# Altium schematic sheet power_supply_blk.SchDoc
size A4; Date: 1/11/2016; Engineer: JBayalas; DocumentNumber: 7; Revision: V4.3.0; SheetNumber: 7; SheetTotal: 12
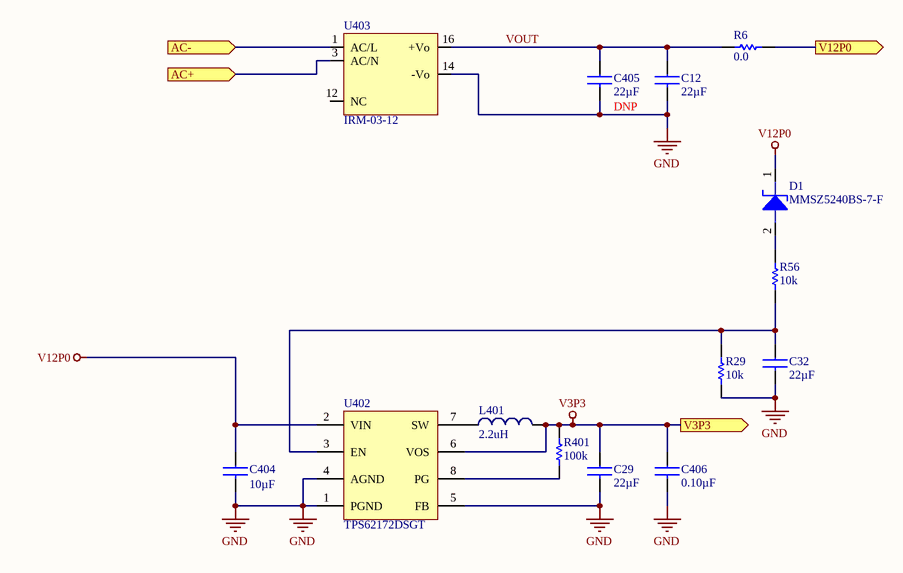
[diagram p0: power_supply_blk.SchDoc]

## Parts
C12  value 22µF  [C0805]  (hidden comment: GRM219R61C226ME15L)
C29  value 22µF  [C0805]  (hidden comment: GRM21BR61C226ME44L)
C32  value 22µF  [C0805]  (hidden comment: GRM219R61C226ME15L)
C404  value 10µF  [C1206]  (hidden comment: GRM31CR71C106KAC7L)
C405  value 22µF  [C0805]  (hidden comment: GRM21BR61C226ME44L)
C406  value 0.10µF  [C0402]  (hidden comment: GRM155R71H104ME14D)
D1  MMSZ5240BS-7-F  [SOD-323]
L401  value 2.2uH  [NR3015]  (hidden comment: NR3015T2R2M)
R6  value 0.0  [R0805]  (hidden comment: 9C08052A0R00JLHFT)
R29  value 10k  [R0603]  (hidden comment: 5-1879337-9)
R56  value 10k  [R0603]  (hidden comment: 5-1879337-9)
R401  value 100k  [R0402]  (hidden comment: ERJ-2RKF1003X)
U402  TPS62172DSGT  [WSON8]
U403  IRM-03-12  [IRM-03-12]

## Ports
AC+ (in), AC- (in), V3P3 (out), V12P0 (out)

## Nets
GND: C12.2 C29.2 C32.2 C404.2 C405.2 C406.2 R29.2 U402.1(PGND) U402.4(AGND) U402.5(FB) U403.14(-Vo)
V3P3: C29.1 C406.1 L401.2 R401.2 U402.6(VOS) ; port V3P3
V12P0: C404.1 D1.1(K) U402.2(VIN)
AC+: U403.3(AC/N) ; port AC+
AC-: U403.1(AC/L) ; port AC-
V12P0: R6.2 ; port V12P0  [a separate net that carries the same name]
VOUT: C12.1 C405.1 R6.1 U403.16(+Vo)
NetC32_1: C32.1 R29.1 R56.2 U402.3(EN)
NetD1_2: D1.2(A) R56.1
NetL401_1: L401.1 U402.7(SW)
NetR401_1: R401.1 U402.8(PG)

Not connected (* = marked no-connect by the designer): U403 12(NC)

## Notes on the sheet
- Title:
- Sheet:
- Date:
- of
- Project:
- Revision:
- Engineer:
- Wi4B S.r.l

## Library data of the parts
C12 C32 = GRM219R61C226ME15L: CAP CER 22UF 16V 20% X5R 0805; MFT: Murata Electronics North America; TYPE: Surface Mount, MLCC; FUNCTION: Power Supply; MPN: GRM219R61C226ME15L; RATING: 16V 20% X5R
C29 C405 = GRM21BR61C226ME44L: CAP CER 22UF 16V X5R 0805; MFT: Murata Electronics North America; TYPE: SMD; FUNCTION: Power Supply; MPN: GRM21BR61C226ME44L; RATING: 16V
  C29: DNP: *
  C405: DNP: DNP
C404 = GRM31CR71C106KAC7L: CAP CER 10UF 16V X7R 1206; MFT: Murata Electronics North America; TYPE: SMD; FUNCTION: Power Supply; MPN: GRM31CR71C106KAC7L; RATING: 16V; DNP: *
C406 = GRM155R71H104ME14D: CAP CER 0.1UF 50V X7R 0402; MFT: Murata Electronics North America; TYPE: SMD; FUNCTION: Power Supply; MPN: GRM155R71H104ME14D; RATING: 50V; DNP: *
D1 = MMSZ5240BS-7-F: DIODE ZENER 10V 200MW SOD323; ALT MPN1: BZT52C10S; MFT: Diodes Incorporated; TYPE: SMD; ALT DESC1: DIODE ZENER 10V 200mW SOD323 BZT52C10S; ALT MFT1: Bytesonic; FUNCTION: Power Supply; VALUE: MMSZ5240BS-7-F; RATING: 10V; LOAD: *; MPN: MMSZ5240BS-7-F; APN: *
L401 = NR3015T2R2M: FIXED IND 2.2UH 1.5A 72 MOHM SMD; MFT: Taiyo Yuden; TYPE: Surface Mount; FUNCTION: Power Supply; MPN: NR3015T2R2M
R6 = 9C08052A0R00JLHFT: RES SMD 0.0 OHM JUMPER 1/8W 0805; MFT: Yageo; FUNCTION: Power Supply; MPN: 9C08052A0R00JLHFT; RATING: Jumper; TYPE: Surface Mount
R29 R56 = 5-1879337-9: RES SMD 10K OHM 1% 1/16W 0603; MPN: ERJ-3EKF1002V; MFT: Panasonic Electronic Components; RATING: 0.063W; FUNCTION: Power Supply; TYPE: SMD; LOAD: *
R401 = ERJ-2RKF1003X: RES SMD 100K OHM 1% 1/10W 0402; MFT: Panasonic Electronic Components; RATING: 0.1W, 1/10W; FUNCTION: Power Supply; MPN: ERJ-2RKF1003X; TYPE: Surface Mount
U402 = TPS62172DSGT: IC REG BUCK 3.3V 0.5A SYNC 8WSON; MFT: TEXAS INSTRUMENTS; FUNCTION: Power Supply; VALUE: TPS62172DSGT; TYPE: SMD; RATING: *; DNP: *; MPN: TPS62172DSGT
U403 = IRM-03-12: AC/DC Power Modules 85-305Vac 12Vout 250mA 3W PCM mnt; MFT: Mean Well; FUNCTION: Power Supply; VALUE: IRM-03-12; MPN: IRM-03-12